# Altium schematic sheet Sheet1.SchDoc
size B
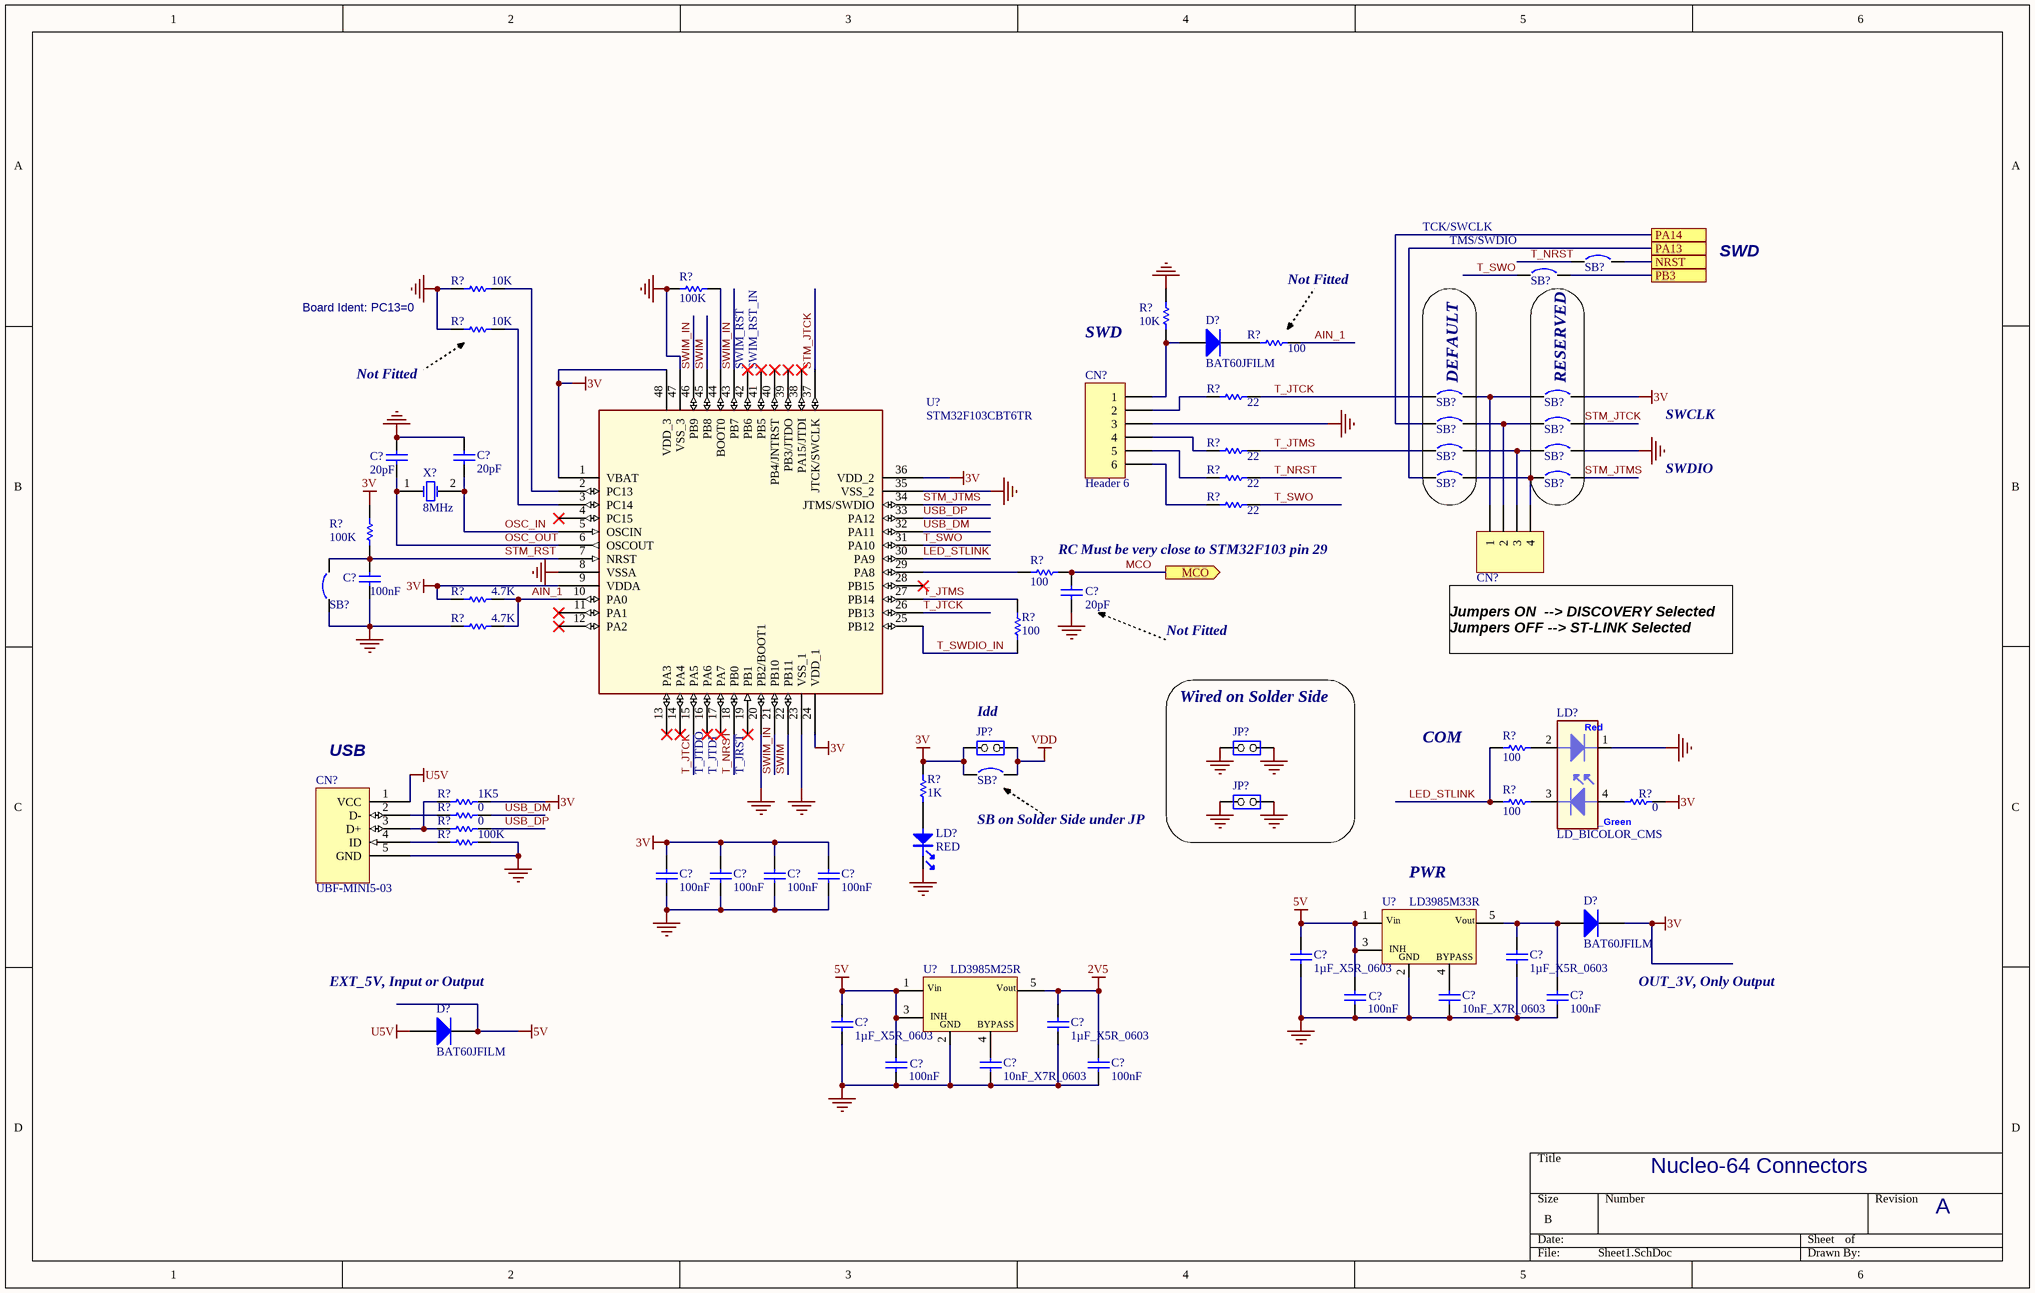
[diagram p0: Sheet1.SchDoc]

## Parts
(Parts that share a designator on the sheet are numbered #1, #2 ... from top to bottom, then left to right.)
C?#1  20pF  [0402C]
C?#2  20pF  [0402C]
C?#3  100nF  [0402C]
C?#4  20pF  [0603C]
C?#5  100nF  [0402C]
C?#6  100nF  [0402C]
C?#7  100nF  [0402C]
C?#8  100nF  [0402C]
C?#9  1µF_X5R_0603  [0603C]
C?#10  1µF_X5R_0603  [0603C]
C?#11  1µF_X5R_0603  [0603C]
C?#12  100nF  [0402C]
C?#13  100nF  [0402C]
C?#14  10nF_X7R_0603  [0603C]
C?#15  1µF_X5R_0603  [0603C]
C?#16  100nF  [0402C]
C?#17  100nF  [0402C]
C?#18  10nF_X7R_0603  [0603C]
CN?#1  Header 6  [HEADER6$2F$2.54]
CN?#2  Header 4  [HEADER4$2F$2.54]  (value not drawn)
CN?#3  UBF-MINI5-03  [USB-MINI-B-SMD-A_]
D?#1  BAT60JFILM  [SOD323$2F$A]
D?#2  BAT60JFILM  [SOD323$2F$A]
D?#3  BAT60JFILM  [SOD323$2F$A]
JP?#1  (no value)  [SIP2$2F$2.54]
JP?#2  (no value)  [SIP2$2F$2.54]
JP?#3  (no value)  [SIP2$2F$2.54]
LD?#1  LD_BICOLOR_CMS  [AV02-0501EN]
LD?#2  RED  [LED0603]
R?#1  10K  [0402R]
R?#2  100K  [0402R]
R?#3  10K  [0402R]
R?#4  10K  [0402R]
R?#5  100  [0402R]
R?#6  22  [0402R]
R?#7  22  [0402R]
R?#8  22  [0402R]
R?#9  22  [0402R]
R?#10  100K  [0402R]
R?#11  100  [0603R]
R?#12  4.7K  [0402R]
R?#13  4.7K  [0402R]
R?#14  100  [0402R]
R?#15  100  [0402R]
R?#16  1K5  [0402R]
R?#17  100  [0402R]
R?#18  0  [0603R]
R?#19  0  [0603R]
R?#20  1K  [0402R]
R?#21  0  [0603R]
R?#22  100K  [0402R]
SB?#1  Circuit Breaker  [JUMPER]  (value not drawn)
SB?#2  Circuit Breaker  [JUMPER]  (value not drawn)
SB?#3  Circuit Breaker  [JUMPER]  (value not drawn)
SB?#4  Circuit Breaker  [JUMPER]  (value not drawn)
SB?#5  Circuit Breaker  [JUMPER]  (value not drawn)
SB?#6  Circuit Breaker  [JUMPER]  (value not drawn)
SB?#7  Circuit Breaker  [JUMPER]  (value not drawn)
SB?#8  Circuit Breaker  [JUMPER]  (value not drawn)
SB?#9  Circuit Breaker  [JUMPER]  (value not drawn)
SB?#10  Circuit Breaker  [JUMPER]  (value not drawn)
SB?#11  Circuit Breaker  [JUMPER]  (value not drawn)
SB?#12  Circuit Breaker  [JUMPER]  (value not drawn)
U?#1  STM32F103CBT6TR  [LQFP48$2F$0.5MM$5C$9X9B]
U?#2  LD3985M33R  [SOT-23-5L]
U?#3  LD3985M25R  [SOT-23-5L]
X?  8MHz  [HC-49A]

## Blocks framed on the sheet
DEFAULT: SB?#3 SB?#5 SB?#7 SB?#9
RESERVED: SB?#4 SB?#6 SB?#8 SB?#10
Wired on Solder Side: JP?#2 JP?#3

## Ports
MCO (out), NRST, PA13, PA14, PB3

## Nets
2V5: C?#11.1 C?#17.2 U?#3.5(Vout)
3V: C?#5.1 C?#6.2 C?#7.2 C?#8.2 D?#2.2(K) JP?#1.1(COMMON) R?#10.2 R?#12.1 R?#16.2 R?#18.2 R?#20.2 SB?#4.2 SB?#12.1 U?#1.1(VBAT) U?#1.9(VDDA) U?#1.24(VDD_1) U?#1.36(VDD_2) U?#1.48(VDD_3)
5V: C?#10.2 C?#12.2 C?#15.2 C?#16.2 D?#3.2(K) U?#2.1(Vin) U?#2.3(CE) U?#3.1(Vin) U?#3.3(CE)
GND: C?#1.1 C?#2.1 C?#3.1 C?#4.2 C?#5.2 C?#6.1 C?#7.1 C?#8.1 C?#9.2 C?#10.1 C?#11.2 C?#12.1 C?#13.1 C?#14.1 C?#15.1 C?#16.1 C?#17.1 C?#18.1 CN?#1.3 CN?#3.5(GND) JP?#2.1(COMMON) JP?#2.2(NO) JP?#3.1(COMMON) JP?#3.2(NO) LD?#1.1 LD?#2.2 R?#1.1 R?#2.1 R?#3.1 R?#4.2 R?#13.1 R?#22.2 SB?#8.2 SB?#11.1 U?#1.8(VSSA) U?#1.20(PB2/BOOT1) U?#1.23(VSS_1) U?#1.35(VSS_2) U?#1.47(VSS_3) U?#2.2(GND) U?#3.2(GND)
U5V: CN?#3.1(VCC) D?#3.1(A)
VDD: JP?#1.2(NO) SB?#12.2
AIN_1: R?#5.2 R?#12.2 R?#13.2 U?#1.10(PA0)
LED_STLINK: R?#15.1 R?#17.1 U?#1.30(PA9)
MCO: C?#4.1 R?#11.2 ; port MCO
NRST: SB?#1.2 ; port NRST
OSC_IN: C?#2.2 U?#1.5(OSCIN) X?.2(OSC2)
OSC_OUT: C?#1.2 U?#1.6(OSCOUT) X?.1(OSC1)
PA13: SB?#9.1 ; port PA13
PA14: SB?#5.1 ; port PA14
PB3: SB?#2.2 ; port PB3
STM_JTCK: SB?#6.2 U?#1.37(JTCK/SWCLK)
STM_JTMS: SB?#10.2 U?#1.34(JTMS/SWDIO)
STM_RST: C?#3.2 R?#10.1 SB?#11.2 U?#1.7(NRST)
SWIM: U?#1.22(PB11) U?#1.45(PB8)
SWIM_IN: U?#1.21(PB10) U?#1.43(PB7) U?#1.46(PB9)
T_JTCK: R?#6.2 SB?#3.1 U?#1.15(PA5) U?#1.26(PB13)
T_JTMS: R?#7.2 R?#14.2 SB?#7.1 U?#1.27(PB14)
T_NRST: R?#8.2 SB?#1.1 U?#1.18(PB0)
T_SWDIO_IN: R?#14.1 U?#1.25(PB12)
T_SWO: R?#9.2 SB?#2.1 U?#1.31(PA10)
USB_DM: R?#19.2 U?#1.32(PA11)
USB_DP: R?#21.2 U?#1.33(PA12)
NetC?#9_1: C?#9.1 C?#13.2 D?#2.1(A) U?#2.5(Vout)
NetC?#14_2: C?#14.2 U?#2.4(BYPASS)
NetC?#18_2: C?#18.2 U?#3.4(BYPASS)
NetCN?#1_1: CN?#1.1 D?#1.1(A) R?#4.1
NetCN?#1_2: CN?#1.2 R?#6.1
NetCN?#1_4: CN?#1.4 R?#7.1
NetCN?#1_5: CN?#1.5 R?#8.1
NetCN?#1_6: CN?#1.6 R?#9.1
NetCN?#2_1: CN?#2.1 SB?#3.2 SB?#4.1
NetCN?#2_2: CN?#2.2 SB?#5.2 SB?#6.1
NetCN?#2_3: CN?#2.3 SB?#7.2 SB?#8.1
NetCN?#2_4: CN?#2.4 SB?#9.2 SB?#10.1
NetCN?#3_2: CN?#3.2(D-) R?#19.1
NetCN?#3_3: CN?#3.3(D+) R?#16.1 R?#21.1
NetCN?#3_4: CN?#3.4(ID) R?#22.1
NetD?#1_2: D?#1.2(K) R?#5.1
NetLD?#1_2: LD?#1.2 R?#15.2
NetLD?#1_3: LD?#1.3 R?#17.2
NetLD?#1_4: LD?#1.4 R?#18.1
NetLD?#2_1: LD?#2.1 R?#20.1
NetR?#1_2: R?#1.2 U?#1.2(PC13)
NetR?#2_2: R?#2.2 U?#1.44(BOOT0)
NetR?#3_2: R?#3.2 U?#1.3(PC14)
NetR?#11_1: R?#11.1 U?#1.29(PA8)

Not connected (* = marked no-connect by the designer): U?#1 4(PC15)* 11(PA1)* 12(PA2)* 13(PA3)* 14(PA4)* 16(PA6)* 17(PA7)* 19(PB1)* 28(PB15)* 38(PA15/JTDI)* 39(PB3/JTDO)* 40(PB4/JNTRST)* 41(PB5)* 42(PB6)*

## Notes on the sheet
- TCK/SWCLK
- Not Fitted
- (near SB?#2) TMS/SWDIO
- SWD
- (near R?#3) Board Ident: PC13=0
- SWIM_RST
- SWIM_RST_IN
- SWCLK
- SWDIO
- (near R?#11) RC Must be very close to STM32F103 pin 29
- Jumpers ON  --> DISCOVERY Selected
  Jumpers OFF --> ST-LINK Selected
- (near CN?#3) USB
- (near U?#1) T_JTDO
- (near U?#1) T_JTDI
- (near U?#1) T_JRST
- (near JP?#1) Idd
- COM
- SB on Solder Side under JP
- (near U?#2) PWR
- (near D?#3) EXT_5V, Input or Output
- OUT_3V, Only Output
- Nucleo-64 Connectors
- A
- (in symbol LD3985M25R) INH
- (in symbol LD3985M33R) INH
- (in symbol LD_BICOLOR_CMS) Red; _Green

## Library data of the parts
C?#1 C?#2 = Cap: Capacitor; Manuf_Part_1: CC0402JRNPO9BN200; Manuf_1: YAGEO; Published: 8-Jun-2000; Publisher: Altium Limited; Value: 20pF; Revision: July-2002: Re-released for DXP Platform.
C?#3 C?#5-C?#8 C?#12 C?#13 C?#16 C?#17 = Cap: Capacitor; Manuf_Part_1: CC0402KRX7R7BB104; Manuf_1: YAGEO; Published: 8-Jun-2000; Revision: July-2002: Re-released for DXP Platform.; Publisher: Altium Limited; Value: 100nF
C?#4 = Cap: Capacitor; Fitted: NO; Published: 8-Jun-2000; Publisher: Altium Limited; Value: 20pF; Revision: July-2002: Re-released for DXP Platform.
C?#9-C?#11 C?#15 = CAP SMD 0603  X5R 1µF 25V 10%: 0603  X5R 1µF; Manuf_1: YAGEO; Manuf_Part_1: CC0603KRX5R7BB105; Value: 1uF; Rated voltage: 25V; Tolerance: 10%; Order code Farnell: 1288202RL; Power: *; Technology: X5R; Temperature  Factor: *; Temperature Max: +125°C; Temperature Min: -55°C; STS Code: *
C?#14 C?#18 = CAP SMD 0603  X7R 10000PF 50V 10%: 0603  X7R 10NF; Manuf_1: YAGEO; Manuf_Part_1: CC0603KRX7R9BB103; Order code RS: 2040779; Rated voltage: 50V; Tolerance: 10%; Order code Farnell: 7569548RL; Value: 10nF; Power: *; Technology: X7R; Temperature Factor: *; Temperature Min: -55°C; Temperature Max: +125°C; STS Code: *
CN?#1 = Header 6: Header, 6-Pin; Manuf_Part_1: 313106S141116; Manuf_1: LYCN; LatestRevisionDate: 17-Jul-2002; LatestRevisionNote: Re-released for DXP Platform.; Publisher: Altium Limited
CN?#2 = Header 4: Header, 4-Pin; Manuf_1: LYCN; Manuf_Part_1: 313104S141116; Revision: 17-Jul-2002: Re-released for DXP Platform.; Publisher: Altium Limited
CN?#3 = USB-MINI-typeB connector_: Manuf_1: MTCONN; Manuf_Part_1: UBF-MINI5-03
D?#1-D?#3 = BAT60JFILM: Manuf_1: STM; Code - JEDEC: DO-214-AB; Provided: ST; Published: 8-Jun-2000; Revision: July-2002: Re-released for DXP Platform.; Publisher: Altium Limited; Order: BAT60JFILM; Manuf_Part_1: BAT60JFILM
JP?#1 = JP2: Manuf_Part_1: 313102S141116; Manuf_1: LYCN
JP?#2 JP?#3 = JP2: Manuf_1: LYCN; Manuf_Part_1: 313102S141145
LD?#1 = LD_BICOLOR_CMS: Bicolor Led; Manuf_Part_1: HSMF-A201-A00J1; Manuf_1: Avago Technologies; Ref St: xxxxxx; cap_dec: ----; Distrib: RADIOSPARES; Footprint: HSMF-A201; support: ----
LD?#2 = PHOTO: Manuf_Part_1: 19-213-R6C-AP1Q2B-3T; Manuf_1: EVERLIGHT
R?#1 R?#4 = res1: Resistor; Manuf_Part_1: RC0402FR-0710KL; Manuf_1: YAGEO; Published: 8-Jun-2000; Revision: July-2002: Re-released for DXP Platform.; Publisher: Altium Limited; Value: 10K
R?#2 R?#10 R?#22 = res1: Resistor; Manuf_Part_1: RC0402FR-07100KL; Manuf_1: YAGEO; Published: 8-Jun-2000; Revision: July-2002: Re-released for DXP Platform.; Publisher: Altium Limited; Value: 100K
R?#3 = res1: Resistor; Manuf_Part_1: RC0402FR-0710KL; Manuf_1: YAGEO; Fitted: NO; Published: 8-Jun-2000; Revision: July-2002: Re-released for DXP Platform.; Publisher: Altium Limited; Value: 10K
R?#5 = res1: Resistor; Fitted: NO; Published: 8-Jun-2000; Revision: July-2002: Re-released for DXP Platform.; Publisher: Altium Limited; Value: 100
R?#6-R?#9 = res1: Resistor; Manuf_Part_1: RC0402FR-0722RL; Manuf_1: YAGEO; Published: 8-Jun-2000; Revision: July-2002: Re-released for DXP Platform.; Publisher: Altium Limited; Value: 22
R?#11 = res1: Resistor; Manuf_Part_1: RC0603FR-07100RL; Manuf_1: YAGEO; Published: 8-Jun-2000; Revision: July-2002: Re-released for DXP Platform.; Publisher: Altium Limited; Value: 100
R?#12 R?#13 = res1: Resistor; Manuf_Part_1: RC0402FR-074K7L; Manuf_1: YAGEO; Published: 8-Jun-2000; Revision: July-2002: Re-released for DXP Platform.; Publisher: Altium Limited; Value: 4.7K
R?#14 R?#15 R?#17 = res1: Resistor; Manuf_Part_1: RC0402FR-07100RL; Manuf_1: YAGEO; Published: 8-Jun-2000; Revision: July-2002: Re-released for DXP Platform.; Publisher: Altium Limited; Value: 100
R?#16 = res1: Resistor; Manuf_Part_1: RC0402FR-071K5L; Manuf_1: YAGEO; Published: 8-Jun-2000; Revision: July-2002: Re-released for DXP Platform.; Publisher: Altium Limited; Value: 1K5
R?#18 R?#19 R?#21 = res1: Resistor; Manuf_Part_1: RC0603JR-070RL; Manuf_1: YAGEO; Published: 8-Jun-2000; Revision: July-2002: Re-released for DXP Platform.; Publisher: Altium Limited; Value: 0
R?#20 = res1: Resistor; Manuf_Part_1: RC0402FR-071KL; Manuf_1: YAGEO; Published: 8-Jun-2000; Revision: July-2002: Re-released for DXP Platform.; Publisher: Altium Limited; Value: 1K
SB?#1-SB?#3 SB?#5 SB?#7 SB?#9 = Circuit Breaker: Solder: YES; Published: 24-Mar-1999; Revision: July-2002: Re-released for DXP Platform.; Publisher: Altium Limited
SB?#4 SB?#6 SB?#8 SB?#10-SB?#12 = Circuit Breaker: Solder: NO; Published: 24-Mar-1999; Revision: July-2002: Re-released for DXP Platform.; Publisher: Altium Limited
U?#1 = STM32F103CBT6: Medium-density performance line ARM-based 32-bit MCU with 128KB Flash; Manuf_1: STM; Ref St: xxxxxxxx; Provided: ST; ECCN_US/EU: 3A991A2/NEC; Footprint: QFP48 7X7; Manuf_Part_1: STM32F103CBT6TR; Order: STM32F103CBT6; Distrib: ST
U?#2 = LD3985M33R: Ultra low drop-low noise BiCMOS voltage, regulators low ESR capacitors compatible; Manuf_1: STM; Provided: ST; Manuf_Part_1: LD3985M33R
U?#3 = LD3985M25R: Ultra low drop-low noise BiCMOS voltage, regulators low ESR capacitors compatible; Manuf_1: STM; Provided: ST; Manuf_Part_1: LD3985M25R
X? = XTAL: Crystal Oscillator; Manuf_Part_1: HC-49S-C20QSA-8.000MHZ; Manuf_1: jfvny; Published: 8-Jun-2000; LatestRevisionDate: 17-Jul-2002; LatestRevisionNote: Re-released for DXP Platform.; PackageReference: R38; Publisher: Altium Limited